# EAGLE design LISN-BZH (EAGLE 6.3)
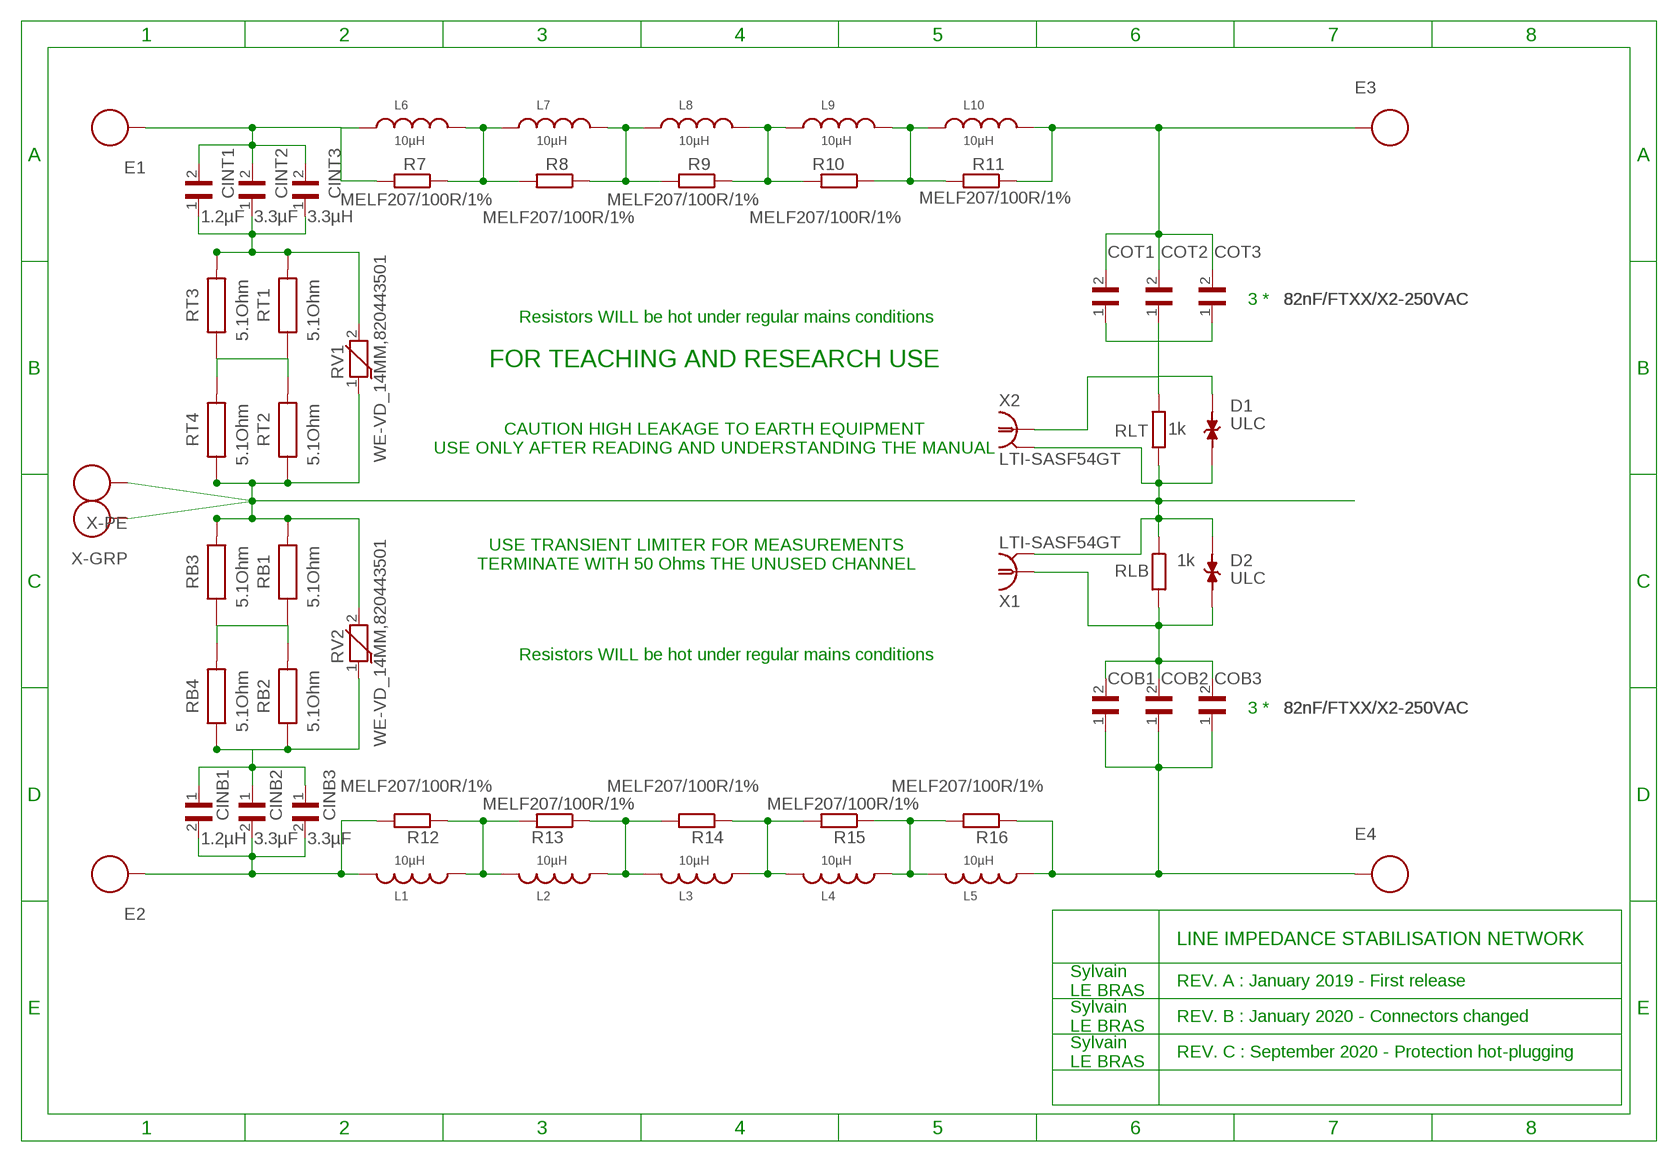
[diagram p0: schematic, sheet 1]

## Parts
CINB1  1.2µH  WCAP-FTXX_890334027025  [WCAP-FTXX_27.5X31X29X15.5]
CINB2  3.3µF  WCAP-FTXX_890334027025  [WCAP-FTXX_27.5X31X29X15.5]
CINB3  3.3µF  WCAP-FTXX_890334027025  [WCAP-FTXX_27.5X31X29X15.5]
CINT1  1.2µF  WCAP-FTXX_890334027025  [WCAP-FTXX_27.5X31X29X15.5]
CINT2  3.3µF  WCAP-FTXX_890334027025  [WCAP-FTXX_27.5X31X29X15.5]
CINT3  3.3µH  WCAP-FTXX_890334027025  [WCAP-FTXX_27.5X31X29X15.5]
COB1  82nF/FTXX/X2-250VAC  WCAP-FTXX_890334023019  [WCAP-FTXX_10X13X13X7]
COB2  82nF/FTXX/X2-250VAC  WCAP-FTXX_890334023019  [WCAP-FTXX_10X13X13X7]
COB3  82nF/FTXX/X2-250VAC  WCAP-FTXX_890334023019  [WCAP-FTXX_10X13X13X7]
COT1  82nF/FTXX/X2-250VAC  WCAP-FTXX_890334023019  [WCAP-FTXX_10X13X13X7]
COT2  82nF/FTXX/X2-250VAC  WCAP-FTXX_890334023019  [WCAP-FTXX_10X13X13X7]
COT3  82nF/FTXX/X2-250VAC  WCAP-FTXX_890334023019  [WCAP-FTXX_10X13X13X7]
D1  ULC  WE-VE_ULC_0603_82306050029  [WE-VE_ULC_0603]
D2  ULC  WE-VE_ULC_0603_82306050029  [WE-VE_ULC_0603]
E1  WP-PLUG_7464000  [PLUG]
E2  WP-PLUG_7464000  [PLUG]
E3  WP-PLUG_7464000  [PLUG]
E4  WP-PLUG_7464000  [PLUG]
L1  10µH  WE-HCC_1210_7443321000  [WE-HCC_1210]
L2  10µH  WE-HCC_1210_7443321000  [WE-HCC_1210]
L3  10µH  WE-HCC_1210_7443321000  [WE-HCC_1210]
L4  10µH  WE-HCC_1210_7443321000  [WE-HCC_1210]
L5  10µH  WE-HCC_1210_7443321000  [WE-HCC_1210]
L6  10µH  WE-HCC_1210_7443321000  [WE-HCC_1210]
L7  10µH  WE-HCC_1210_7443321000  [WE-HCC_1210]
L8  10µH  WE-HCC_1210_7443321000  [WE-HCC_1210]
L9  10µH  WE-HCC_1210_7443321000  [WE-HCC_1210]
L10  10µH  WE-HCC_1210_7443321000  [WE-HCC_1210]
R7  MELF207/100R/1%  R-EU_MELF0207R  [MINI_MELF-0207R]
R8  MELF207/100R/1%  R-EU_MELF0207R  [MINI_MELF-0207R]
R9  MELF207/100R/1%  R-EU_MELF0207R  [MINI_MELF-0207R]
R10  MELF207/100R/1%  R-EU_MELF0207R  [MINI_MELF-0207R]
R11  MELF207/100R/1%  R-EU_MELF0207R  [MINI_MELF-0207R]
R12  MELF207/100R/1%  R-EU_MELF0207R  [MINI_MELF-0207R]
R13  MELF207/100R/1%  R-EU_MELF0207R  [MINI_MELF-0207R]
R14  MELF207/100R/1%  R-EU_MELF0207R  [MINI_MELF-0207R]
R15  MELF207/100R/1%  R-EU_MELF0207R  [MINI_MELF-0207R]
R16  MELF207/100R/1%  R-EU_MELF0207R  [MINI_MELF-0207R]
RB1  5.1Ohm  WRIS-KWKB_1225_561020163017  [WRIS-KWKB_1225]
RB2  5.1Ohm  WRIS-KWKB_1225_561020163017  [WRIS-KWKB_1225]
RB3  5.1Ohm  WRIS-KWKB_1225_561020163017  [WRIS-KWKB_1225]
RB4  5.1Ohm  WRIS-KWKB_1225_561020163017  [WRIS-KWKB_1225]
RLB  1k  R-EU_M0805  [M0805]
RLT  1k  R-EU_M0805  [M0805]
RT1  5.1Ohm  WRIS-KWKB_1225_561020163017  [WRIS-KWKB_1225]
RT2  5.1Ohm  WRIS-KWKB_1225_561020163017  [WRIS-KWKB_1225]
RT3  5.1Ohm  WRIS-KWKB_1225_561020163017  [WRIS-KWKB_1225]
RT4  5.1Ohm  WRIS-KWKB_1225_561020163017  [WRIS-KWKB_1225]
RV1  WE-VD_14MM,820443501  [WE-VD_14MM-0.9]
RV2  WE-VD_14MM,820443501  [WE-VD_14MM-0.9]
X1  LTI-SASF54GT  [LTI-SASF54GT]
X2  LTI-SASF54GT  [LTI-SASF54GT]
X-GRP  WP-THRSH_74651175(R)  [THRXU_1.85_4PINS_7X7]
X-PE  WP-THRSH_74651175(R)  [THRXU_1.85_4PINS_7X7]

## Nets
GND: D1.2 D2.2 RB1.2 RB3.2 RLB.1 RLT.1 RT2.1 RT4.1 RV1.1 RV2.2 X1.2(GND) X2.2(GND) X-GRP.1 X-GRP.2 X-GRP.3 X-GRP.4 X-PE.1 X-PE.2 X-PE.3 X-PE.4
GND1: CINB1.1 CINB2.1 CINB3.1 RB2.1 RB4.1 RV2.1
N$1: CINT1.1 CINT2.1 CINT3.1 RT1.2 RT3.2 RV1.2
N$4: L9.2 L10.1 R10.1 R11.2
N$5: L4.2 L5.1 R15.1 R16.2
N$6: L3.2 L4.1 R14.1 R15.2
N$7: L2.2 L3.1 R13.1 R14.2
N$8: L1.2 L2.1 R12.1 R13.2
N$9: COB1.1 COB2.1 COB3.1 E4.1 E4.2 E4.3 E4.4 E4.5 E4.6 E4.7 E4.8 E4.9 E4.10 E4.11 E4.12 L5.2 R16.1
N$10: CINB1.2 CINB2.2 CINB3.2 E2.1 E2.2 E2.3 E2.4 E2.5 E2.6 E2.7 E2.8 E2.9 E2.10 E2.11 E2.12 L1.1 R12.2
N$11: L8.2 L9.1 R9.1 R10.2
N$12: COB1.2 COB2.2 COB3.2 D2.1 RLB.2 X1.1
N$14: L7.2 L8.1 R8.1 R9.2
N$15: L6.2 L7.1 R7.1 R8.2
N$16: COT1.2 COT2.2 COT3.2 E3.1 E3.2 E3.3 E3.4 E3.5 E3.6 E3.7 E3.8 E3.9 E3.10 E3.11 E3.12 L10.2 R11.1
N$17: CINT1.2 CINT2.2 CINT3.2 E1.1 E1.2 E1.3 E1.4 E1.5 E1.6 E1.7 E1.8 E1.9 E1.10 E1.11 E1.12 L6.1 R7.2
N$18: COT1.1 COT2.1 COT3.1 D1.1 RLT.2 X2.1
N$19: RT1.1 RT2.2 RT3.1 RT4.2
N$22: RB1.1 RB2.2 RB3.1 RB4.2

## Notes on the sheet
- 3 *
- Resistors WILL be hot under regular mains conditions
- FOR TEACHING AND RESEARCH USE
- CAUTION HIGH LEAKAGE TO EARTH EQUIPMENT
  USE ONLY AFTER READING AND UNDERSTANDING THE MANUAL
- USE TRANSIENT LIMITER FOR MEASUREMENTS
  TERMINATE WITH 50 Ohms THE UNUSED CHANNEL
- Resistors WILL be hot under regular mains conditions
- 3 *
- LINE IMPEDANCE STABILISATION NETWORK
- Sylvain
  LE BRAS
- REV. A : January 2019 - First release
- Sylvain
  LE BRAS
- REV. B : January 2020 - Connectors changed
- Sylvain
  LE BRAS
- REV. C : September 2020 - Protection hot-plugging

## Power pins joined to a net without a drawn wire
GND: X1.3(GND) X1.4(GND) X1.5(GND) X2.3(GND) X2.4(GND) X2.5(GND)

## Library data of the parts
CINB1-CINB3 CINT1-CINT3 COB1-COB3 COT1-COT3 = Eagle_Wurth_Elektronik_Passive_Capacitors_rev15a:WCAP-FTXX: WCAP-FTXX Film Capacitors Characteristics MKP,Metallized Polypropylene Film Recommended soldering :Wave Operating temperature:-40 °C to +105 °C Climate category: 40/105/56/B Self-healing properties Certificates: cULus, CQC, VDE Applications Safety applications Filter Power supplies Electrical property <http://katalog.we-online.de/media/images/eisos/WCAP-FTXX_pf2.jpg> Details see: http://katalog.we-online.de/pbs/datasheet/890334022007.pdf Created: 2014-09-15 2014 (C) Wurth Elektronik
D1 D2 = SignalCommunications (rev18d):WE-VE_ULC_0603: WE-VE ULC ESD Suppressor Characteristics Fast response time No leakage current Low clamping voltage Almost no energy consumption in stand-by mode Excellent absorption for ESD-impulses Operating temperature: –40 ºC to +85 ºC Nickel barrier Applications Protection of data lines Protection of bus systems Protection of semiconductors ESD protection in accordance with EN 61000-4-2 – 8 kV contact discharge – 15 kV air discharge <http://katalog.we-online.de/media/images/v2/Family_WE-VE_ULC.jpg> Details see: http://katalog.we-online.de/en/pbs/WE-VE_ULC? Updated by Dan Xu 2014-07-11 2014 (C) Wurth Elektronik
E1-E4 = Eagle_REDCUBE (rev19a):WP-PLUG: REDCUBE Plug Terminal WP-PLUG Characteristics PROPERTIES: Color Red Insulator Material PBT Contact Material Copper Alloy Contact Plating Tin Flammability Rating UL94-V0 Operating Temperature -45 °C up to +125 °C Execution Press-Fit Pins 12 ELECTRICAL PROPERTIES: Rated Current 120 A Contact Resistance 1 mΩ PACKAGING PROPERTIES: Packaging Bulk Applications Reversible high current Wire-to-Board connections Battery charger Tool-free and screwless connections Multiple pluggable solutions Mounting in very tight spaces / Mounting areas with difficult access <http://katalog.we-online.de/media/images/v2/Family_WP-PLUG_7464000.jpg=> Details see: http://katalog.we-online.de/en/em/WP-PLUG_DIRECT_PLUG 2016 (C) Wurth Elektronik
L1-L10 = SignalCommunications (rev18d):WE-HCC_1210: SMD High Current Cube Inductor Characteristics Magnetically shielded Operating temperature: –40 °C to +125 °C Current capability up to 27 A Excellent saturation characteristics Applications Filter choke for DC/DC converter Single and polyphase buck converter Filter choke for motor electronics <http://katalog.we-online.de/media/images/v2/Family_WE-HCC.jpg> Details see: http://katalog.we-online.de/en/pbs/WE-HCC? Updated by Dan Xu 2014-05-19 2014 (C) Wurth Elektronik; WE-NUMBER: 7443321000/10uH
R7-R16 = resistor:R-EU_: RESISTOR, European symbol
RB1-RB4 RT1-RT4 = 561020163018_Eagle_WRIS-KWKB_rev19a:WRIS-KWKB_1225: WRIS-KWKB Thick Film Resistors High Power Current Sensing, Wide Terminal Characteristics Product series for high power current sensing up to 2 W Mounting style: SMT-Chip (wide terminal) Resistance range: 2.2 Ω ‒ 18 kΩ Resistance tolerance: ±1 %; ±5 % Rated Power: 0.75 W ‒ 2W TCR: ±200 ppm/°C Operating temperature: -55°C up to +155°C Sizes: 0612 / 1020 / 1225 Recommended soldering: Reflow soldering Applications Electric motor Camera Lighting control TV <https://katalog.we-online.com/media/images/v2/o135741v209%20Family_WRIS-KWKB.jpg> Details see: https://katalog.we-online.com/en/pbs/WRIS-KWKB Created by Ella Wu 2019-09-06 2019(C) Wurth Elektronik; DATASHEET-URL: https://katalog.we-online.de/pbs/datasheet/561020163017.pdf; IR: 626.2mA; MOUNT: SMT; PART-NUMBER: 561020163017; PRATED: 2W; TCR: ±200ppm/ °C; TECHNICAL-REFERENCE: KB12255R10F201DAATE0000
RLB RLT = rcl:R-EU_: RESISTOR, European symbol
RV1 RV2 = Wurth_Elektronik_Passive_rev15b:WE-VD_14MM: WE-VD Disk Varistor Characteristics Low clamping voltage After a surge impulse the varistor works immediately in normal mode so there is no slip current Excellent absorption at surge impulses Operating temperature: –40 ºC to +85 ºC for types up to 95 VRMS –40 ºC to +125 ºC for types from 115 VRMS Response time < 25 ns UL1449 3rd Edition, CSA and VDE approved UL: File E332875 CSA: File 224856 VDE: File 40016986 and 40016998 IEC: 60950-1: 2005 Annex Q from ∅ 10 mm Applications 12–48 VDC distribution 110–400 V power supply Leakage of voltage peaks Surge protection in accordance with EN 61000-4-5 <http://katalog.we-online.de/media/images/eisos/VarVD_pf2.jpg> Details see: http://katalog.we-online.de/en/pbs/WE-VD? Updated by Dan Xu 2014-07-11 2014 (C) Wurth Elektronik; COMPANY-URL: http://www.we-online.de; CREATED-BY: Christin Zierenner; CREATED-DATE: May 2012; DATASHEET-URL: http://katalog.we-online.de/kataloge/eisos/index.php?language=en&pf=WE-VD; MANUFACTURER: Würth Elektronik eiSos GmbH
X1 X2 = con-coax:LTI-SASF54GT: SMA vertical PCB thrue hole jack Source: Lighthorse Technologies, inc. SASF54GT.pdf; OC_FARNELL: unknown; OC_NEWARK: unknown
X-GRP X-PE = EAGLE-REDCUBE_THR-rev16b:WP-THRSH: REDCUBE THR Terminal with external thread WP-THRSH Characteristics ARTICLE PROPERTIES: Height 8.5 mm;​ 10.5 mm Height 11 mm;​ 13 mm Width 7 mm;​ 10 mm Thread Length 5 mm;​ 7 mm PROPERTIES: Material Brass Surface Tin Tightening Torque 0.5 Nm;​ 1.2 Nm;​ 2.2 Nm Solder Cream Thickness 150 µm Operating Temperature -55 °C up to +150 °C Pins 4;​ 9 ELECTRICAL PROPERTIES: Rated Current 50 A;​ 85 A PACKAGING PROPERTIES: Packaging Bulk;​ Tape and Reel Packaging Unit (Qty.) 350;​ 300 Applications Solderable high current Wire-to-Board connections with a focus on automated assembly Angled assembling of cable or PCBs Angled assembling of PCBs on housings <http://katalog.we-online.de/media/images/v2/Family_WP-THRSH_746511xx.jpg=> Details see: http://katalog.we-online.de/en/em/THRSH_THR_SHANK 2016 (C) Wurth Elektronik

## Board
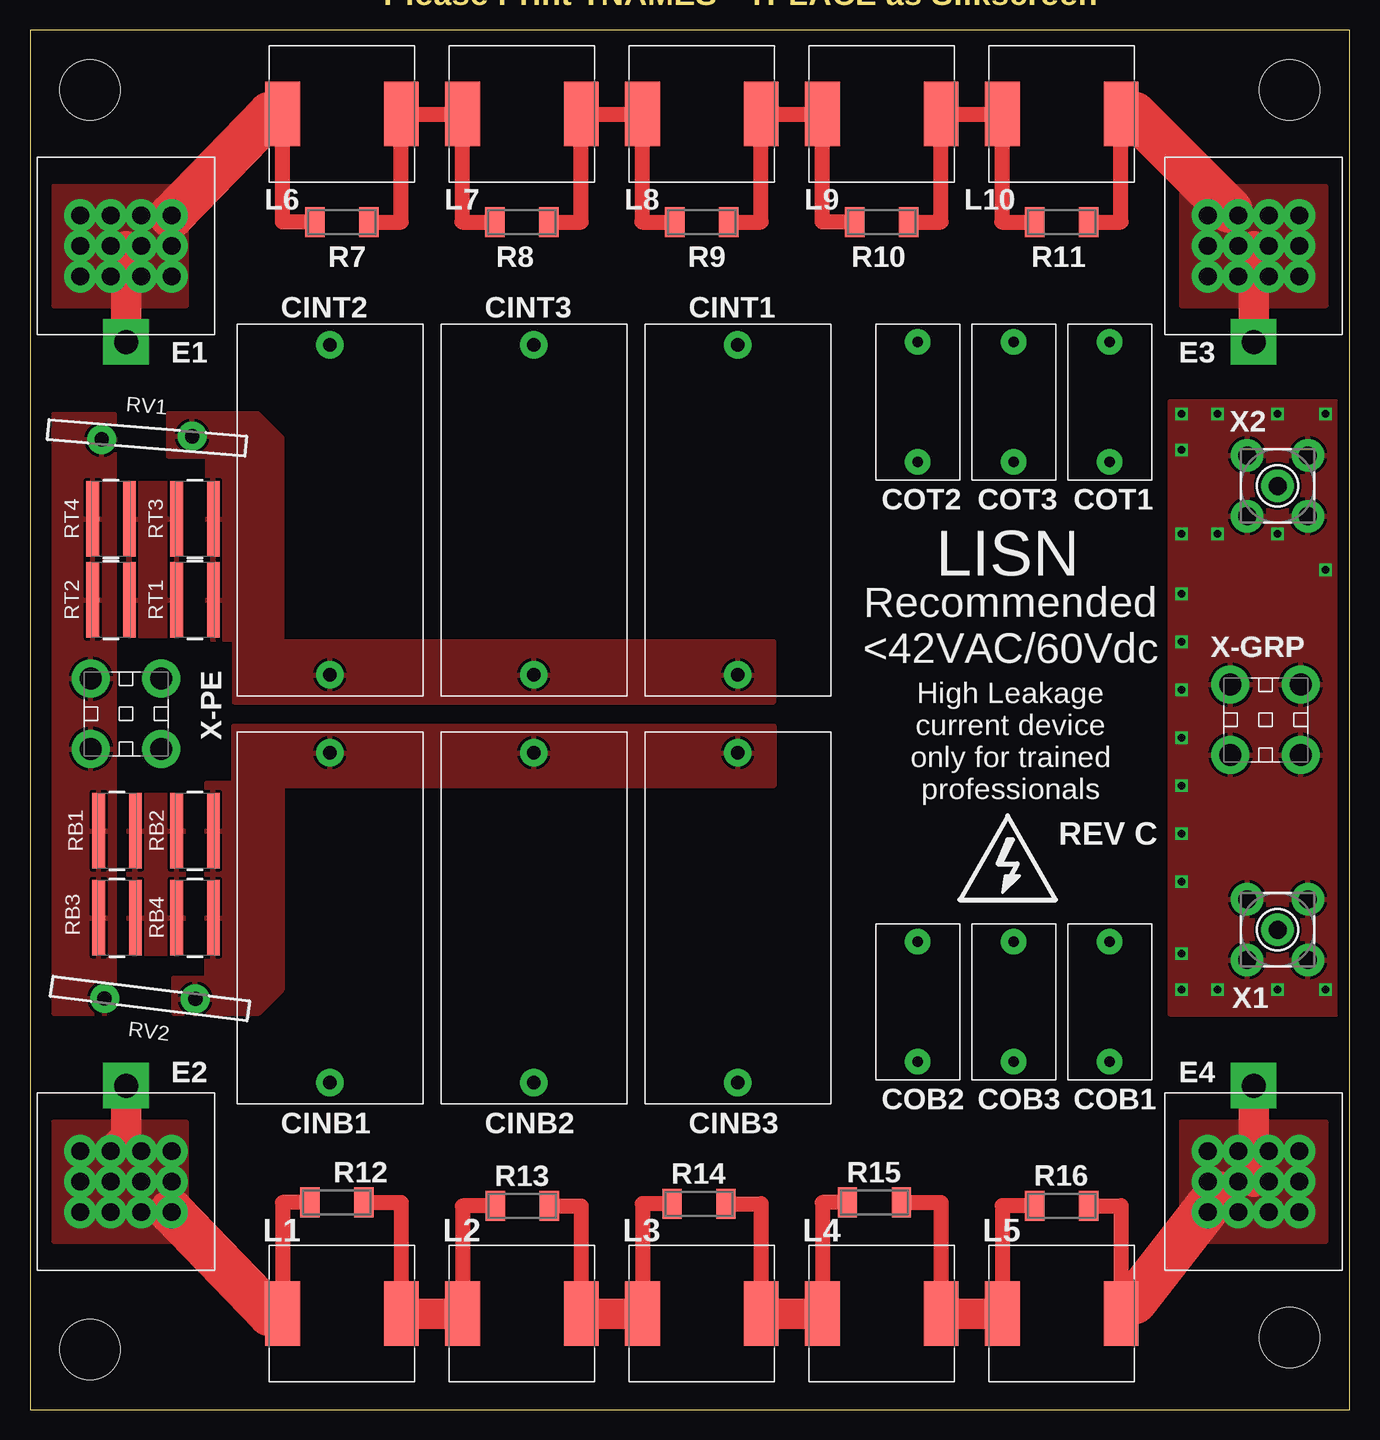
[diagram p1: board, top side]
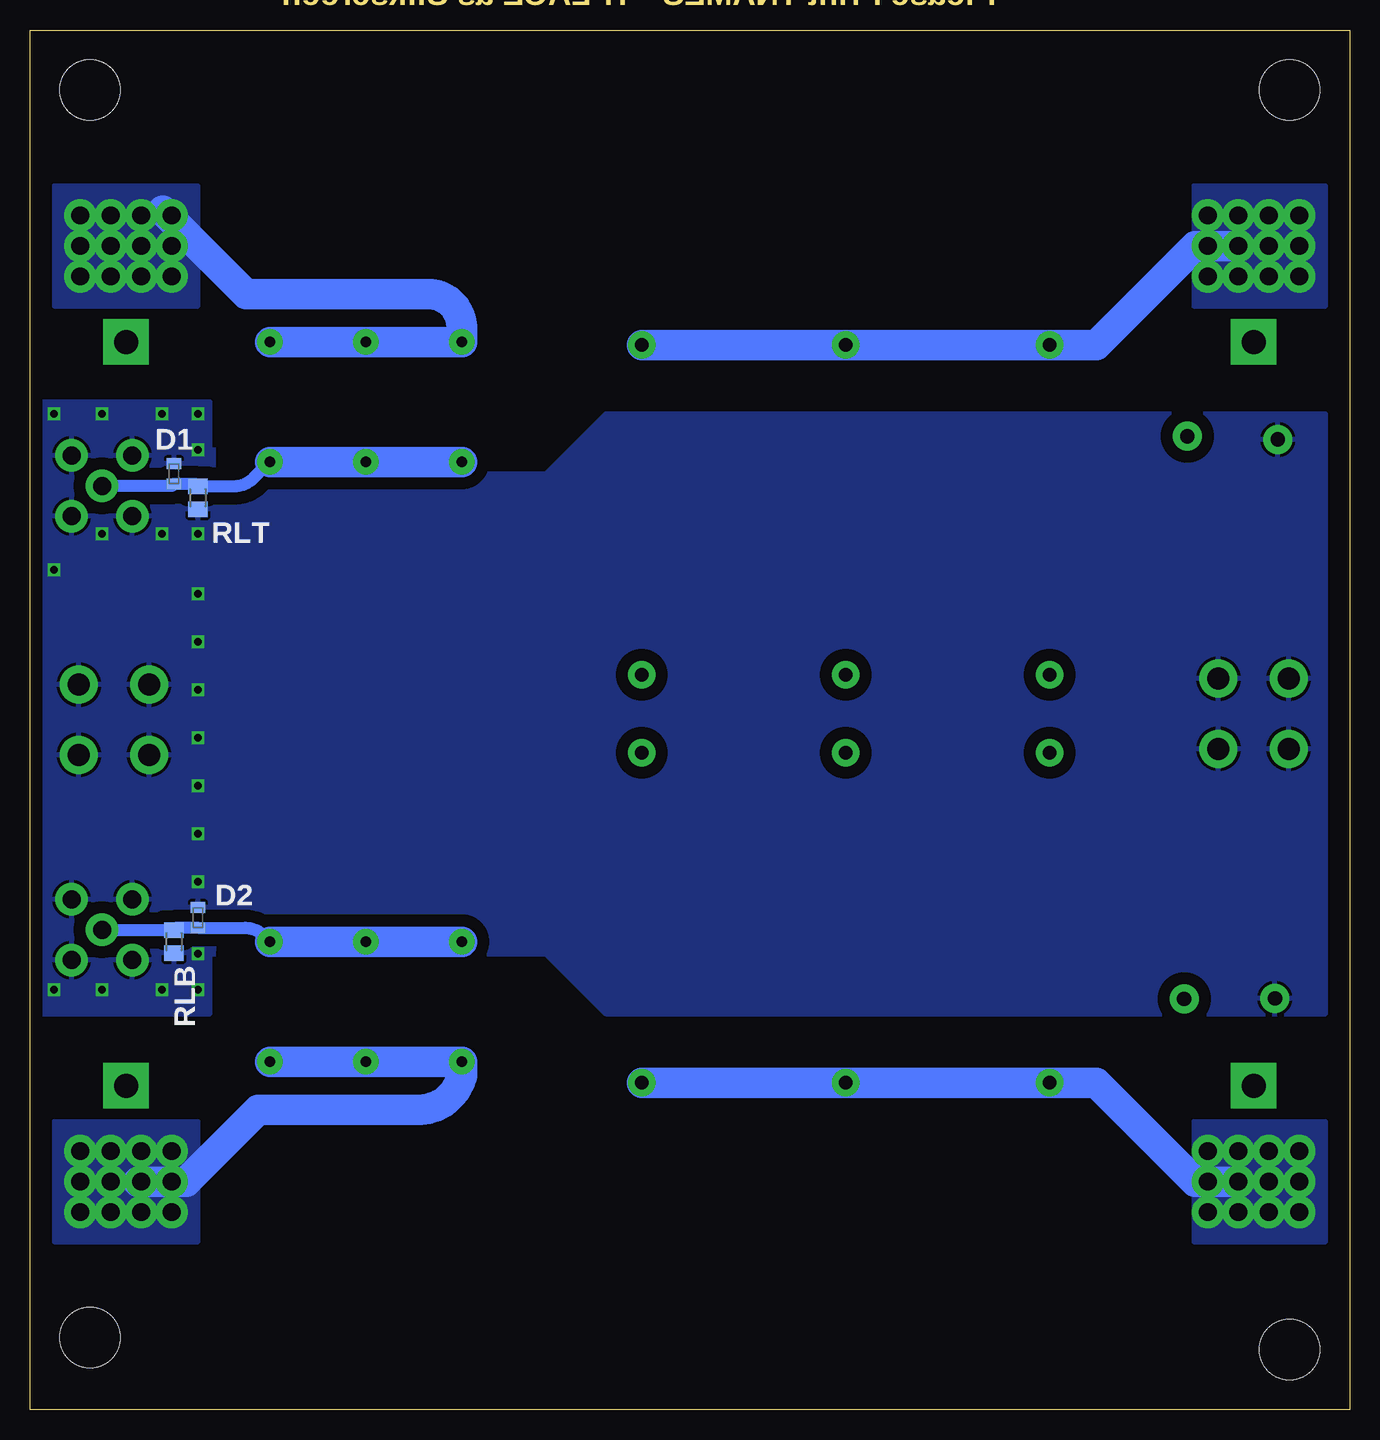
[diagram p2: board, bottom side, seen from below]

Size 110 x 115 mm. Coordinates in mm from the lower left corner, seen from the top.
Outline: 0,0 110,0 110,115 0,115 0,0
Copper layers (1*16): Top 0.035mm / dielectric 1.5mm / Bottom 0.035mm
Design rules "default *": minimum track width 10mil, minimum drill 0.5mm, track to track 8mil, track to pad 8mil, pad to pad 8mil, via to via 8mil, smd to smd 8mil, copper to edge 40mil, drill to drill 8mil, minimum pad ring 0.6mm, minimum via ring 8mil, stop-mask expansion 4mil, vias tented up to drill 0mil, thermal gap 10mil
Holes 5 mm at 5,110 5,5 105,6 105,110
bRestrict: 2 lines

### Footprints (pad centres in the part's own frame; a part is rotated, then mirrored left to right if it is on the bottom)
WCAP-FTXX_27.5X31X29X15.5 = drill 1.1: 1 -13.75,0; 2 13.75,0
WCAP-FTXX_10X13X13X7 = drill 0.9: 1 -5,0; 2 5,0
WE-VE_ULC_0603 = smd 0.9 x 1.2: 1 -0.85,0; 2 0.85,0
PLUG = drill 1.475 pad 1.6: 1 -2.54,3.81; 2 0,3.81; 3 2.54,3.81; 4 2.54,1.27; 5 0,1.27; 6 -2.54,1.27; 7 -2.54,-1.27; 8 0,-1.27; 9 2.54,-1.27; 10 2.54,-3.81; 11 0,-3.81; 12 -2.54,-3.81
WE-HCC_1210 = smd 2.9 x 5.4: 1 -4.95,0; 2 4.95,0
MINI_MELF-0207R = smd 1.6 x 2.5: 1 -2.25,0; 2 2.25,0
WRIS-KWKB_1225 = smd 6.3 x 1.05: 1 0,1.525; 2 0,-1.525
M0805 = smd 1.3 x 1.6: 1 -0.95,0; 2 0.95,0
WE-VD_14MM-0.9 = drill 1.2: 1 -3.75,-0.45; 2 3.75,0.45
LTI-SASF54GT = drill 1.5 pad 2.2: 1 0,0; 2 -2.54,2.54; 3 2.54,2.54; 4 2.54,-2.54; 5 -2.54,-2.54
THRXU_1.85_4PINS_7X7 = drill 1.85 pad 3.2: 1 -2.935,-2.935; 2 -2.935,2.935; 3 2.935,2.935; 4 2.935,-2.935

### Placement (x,y rotation side)
CINB1  25,41 270 top
CINB2  42,41 270 top
CINB3  59,41 270 top
CINT1  59,75 90 top
CINT2  25,75 90 top
CINT3  42,75 90 top
COB1  90,34 90 top
COB2  74,34 90 top
COB3  82,34 90 top
COT1  90,84 90 top
COT2  74,84 90 top
COT3  82,84 90 top
D1  98,78 90 bottom
D2  96,41 90 bottom
E1  8,97 270 top
E2  8,19 90 top
E3  102,97 90 top
E4  102,19 90 top
L1  26,8 0 top
L2  41,8 0 top
L3  56,8 0 top
L4  71,8 0 top
L5  86,8 0 top
L6  26,108 0 top
L7  41,108 0 top
L8  56,108 0 top
L9  71,108 0 top
L10  86,108 0 top
R7  26,99 180 top
R8  41,99 180 top
R9  56,99 180 top
R10  71,99 180 top
R11  86,99 180 top
R12  25.59,17.27 180 top
R13  41.04,16.97 180 top
R14  55.76,17.16 180 top
R15  70.39,17.27 180 top
R16  86,17 180 top
RB1  7.25,48.25 270 top
RB2  13.75,48.25 270 top
RB3  7.25,41 270 top
RB4  13.75,41 270 top
RLB  98,39 90 bottom
RLT  96,76 90 bottom
RT1  13.75,67.5 90 top
RT2  6.75,67.5 90 top
RT3  13.75,74.25 90 top
RT4  6.75,74.25 90 top
RV1  9.75,81 355.2 top
RV2  10,34.25 172.9 top
X1  104,40 90 top
X2  104,77 0 top
X-GRP  103,57.5 0 top
X-PE  8,58 180 top

### Tracks (layer width: path | path; a pad name or v marks a point on that pad's centre or on a via)
GND  (via drill 0.6)
  other vias: 96,80 104,83 108,83 96,73 99,73 104,73 108,70 96,68 96,64 96,60 96,56 96,52 96,48 96,44 96,35 96,83 99,83 99,35 104,35 108,35 96,38
  pour Bottom (isolate 1.016, rank 2): 2,83 62,83 67,78 90,78 92,80 95,80 95,84 109,84 109,33 95,33 95,38 67,38 62,33 2,33
  pour Top: 2,83 7,83 7,33 2,33
  pour Top (isolate 0.61): 109,84 95,84 95,33 109,33
GND1
  pour Top: 12,36 14.75,36 14.75,52.25 17,52.25 17,57 62,57 62,52 21,52 21,35 19,33 12,33
N$1
  pour Top: 11.5,79.5 14.75,79.5 14.75,64.25 17,64.25 17,59 62,59 62,64 21,64 21,81 19,83 11.5,83
N$4
  Top 1.27: R10.1 75.95,99 L9.2 81,108 | L10.1 81,108 | 81,108 81,99 R11.2
N$5
  Top 1.27: R15.1 75.95,17.27 L4.2 | R16.2 81.05,17 L5.1
  Top 2.54: L4.2 L5.1
N$6
  Top 1.27: R14.1 60.95,17.16 L3.2 | R15.2 66.05,17.27 L4.1
  Top 2.54: L3.2 L4.1
N$7
  Top 1.27: R13.1 45.95,16.97 L2.2 | R14.2 51.05,17.16 L3.1
  Top 2.54: L2.2 L3.1
N$8
  Top 1.27: R12.1 30.95,17.27 L1.2 | R13.2 36.05,16.97 L2.1
  Top 2.54: L1.2 L2.1
N$9  (via drill 2 pad 3.81)
  Top 1.27: R16.1 90.95,17 L5.2
  Top 2.54: L5.2 92,9 | v102,27 102,19
  Top 3.81: 99,18 92,9
  Bottom 2.54: 101,19 97,19 91,25 77.83,25 arc-80 74,27.83 COB2.1 COB3.1 COB1.1
  pour Bottom (no thermals): 96,24 108,24 108,14 96,14
  pour Top (no thermals): 96,24 108,24 108,14 96,14
N$10  (via drill 2 pad 3.81)
  Top 1.27: R12.2 21.05,17.27 L1.1
  Top 2.184: 20,8 L1.1
  Top 2.54: E2.4 8,22.81 v8,27
  Top 3.81: 20,8 E2.12
  Bottom 2.54: CINB3.2 CINB2.2 CINB1.2 21.12,27.25 12.87,19 E2.8
  pour Bottom (no thermals): 2,24 13,24 13,14 2,14
  pour Top (no thermals): 2,24 13,24 13,14 2,14
N$11
  Top 1.27: R9.1 60.95,99 L8.2 L9.1 66.05,99 R10.2
N$12
  Bottom 0.305: 97.8,40.15 arc90 RLB.2
  Bottom 1.016: COB1.2 90.51,39.51 arc-45 92.05,40.15 D2.1 97.8,40.15 | RLB.2 103.95,39.95 X1.1
  Bottom 2.54: COB2.2 COB3.2 COB1.2
N$14
  Top 1.27: R8.1 45.95,99 L7.2 51,108 | L8.1 51,108 | 51,108 51,99 R9.2
N$15
  Top 1.27: R7.1 30.95,99 L6.2 L7.1 36,108 36,99 R8.2
N$16  (via drill 2 pad 3.81)
  Top 1.27: R11.1 90.95,99 L10.2 92,108
  Top 2.54: v102,89 102,97
  Top 3.81: 100,100 92,108
  Bottom 2.54: 98.94,99.94 92,93 76.83,93 arc90 74,90.17 COT2.2 COT1.2 COT3.2
  pour Bottom (no thermals): 96,102 108,102 108,92 96,92
  pour Top (no thermals): 96,102 108,102 108,92 96,92
N$17  (via drill 2 pad 3.81)
  Top 1.27: R7.2 21.05,99 L6.1 20,108
  Top 2.54: v8,89 8,97
  Top 3.81: E1.1 20,108
  Bottom 2.54: CINT1.2 CINT3.2 CINT2.2 21.12,88.75 12.87,97 E1.5
  pour Bottom (no thermals): 2,102 13,102 13,92 2,92
  pour Top (no thermals): 2,102 13,102 13,92 2,92
N$18
  Bottom 1.016: COT1.1 91.39,77.61 arc45 92.99,76.95 RLT.2 96.2,77.15 D1.1 98.15,77 X2.1
  Bottom 1.27: 95.95,77 RLT.2
  Bottom 2.54: COT2.1 COT3.1 COT1.1
N$19
  pour Top: 8.25,77.25 12.5,77.25 12.5,64.5 8.25,64.5
N$22
  pour Top: 8.25,51.25 12.75,51.25 12.75,38 8.25,38

### Text on the board
Dimension: Please Print TNAMES - TPLACE as Silkscreen
tNames: LISN | Recommended / <42VAC/60Vdc | High Leakage / current device / only for trained / professionals | REV C
Heatsink: WURTH ELEKTRONIK | WURTH ELEKTRONIK | WURTH ELEKTRONIK